# Altium schematic sheet 1_P1.schdoc.schdoc
size 220 x 160 mm; Symbol: Sheet-Symbol_A4; Device: Sheet-Symbol_A4; Company: 杭州科技职业技术学院; Version: V1.0; Page Size: A5; @Project Name: 2024毕设; @Page Count: 1; @Update Date: 2024-05-05; @Create Date: 2024-05-05; @Schematic Name: 充放一体模块; @Page No: 1; @Page Name: P1
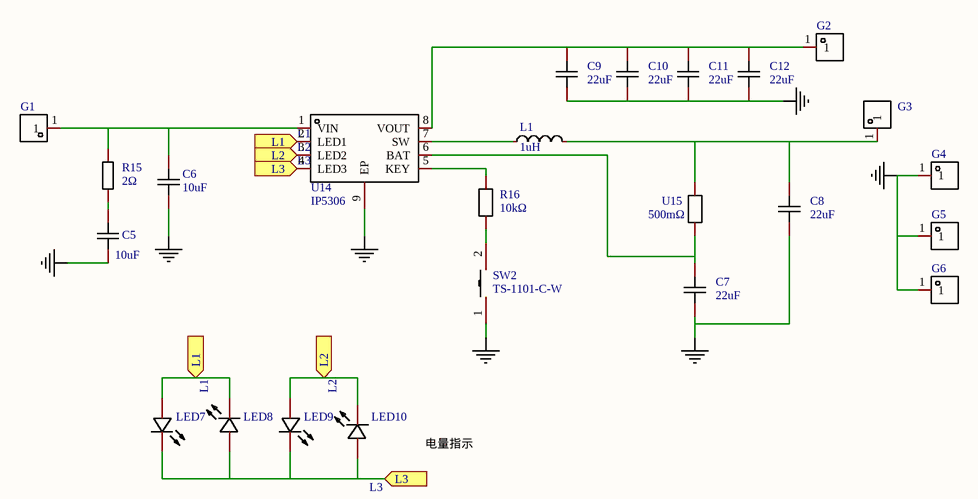
[diagram p0: 1_P1.schdoc.schdoc]

## Parts
C5  10uF  [C0805]
C6  10uF  [C0805]
C7  22uF  [C0805]
C8  22uF  [C0805]
C9  22uF  [C0805]
C10  22uF  [C0805]
C11  22uF  [C0805]
C12  22uF  [C0805]
G1  封闭邮票焊盘  [1P]  (value not drawn)
G2  封闭邮票焊盘  [1P]  (value not drawn)
G3  封闭邮票焊盘  [1P]  (value not drawn)
G4  封闭邮票焊盘  [1P]  (value not drawn)
G5  封闭邮票焊盘  [1P]  (value not drawn)
G6  封闭邮票焊盘  [1P]  (value not drawn)
L1  1uH  [IND-SMD_L4.4-W4.2]
LED7  NCD0805R1  [LED0805-R-RD]  (value not drawn)
LED8  NCD0805R1  [LED0805-R-RD]  (value not drawn)
LED9  NCD0805R1  [LED0805-R-RD]  (value not drawn)
LED10  NCD0805R1  [LED0805-R-RD]  (value not drawn)
R15  2Ω  [R0805]
R16  10kΩ  [R0805]
SW2  TS-1101-C-W  [SW-SMD_L6.0-W3.3-LS8.0]
U14  IP5306  [ESOP-8_L4.9-W3.9-P1.27-LS6.0-BL-EP]
U15  500mΩ  [R0805]

## Ports
L1 (in), L2 (in), L3 (in)

## Nets
NetC5_2: C5.2 C6.1 C7.1 C8.1 C9.1 C10.1 C11.2 C12.1 G4.1 G5.1 G6.1 SW2.1 U14.9(EP)
L1: LED7.1(+) LED8.2(-) U14.2(LED1) ; port L1
L2: LED9.1(+) LED10.2(-) U14.3(LED2) ; port L2
L3: LED7.2(-) LED8.1(+) LED9.2(-) LED10.1(+) U14.4(LED3) ; port L3
NetC5_1: C5.1 R15.1
NetC6_2: C6.2 G1.1 R15.2 U14.1(VIN)
NetC7_2: C7.2 U14.6(BAT) U15.1
NetC8_2: C8.2 G3.1 L1.2 U15.2
NetC9_2: C9.2 C10.2 C11.1 C12.2 G2.1 U14.8(VOUT)
NetL1_1: L1.1 U14.7(SW)
NetR16_1: R16.1 SW2.2
NetR16_2: R16.2 U14.5(KEY)

## Notes on the sheet
- 电量指示
- 1
- 2
- 3
- 4
- 5
- 6
- A
- B
- C
- 原理图
- 充放一体模块
- 创建日期
- 更新日期
- 2024-05-05
- 审阅
- 绘制
- 图页
- P1
- 物料编码
- 2024毕设
- D
- 版本
- 尺寸
- 页
- 共
- V1.0
- A5
- 杭州科技职业技术学院

## Library data of the parts
C5 C6 = GRM21BR61H106KE43L: Manufacturer: muRata(村田); Add into BOM: yes; Tolerance: ±10%; Voltage Rated: 50V; Temperature Coefficient: X5R; Description: 容值:10uF;精度:±10%;额定电压:50V;材质(温度系数):X5R;; Name: 10uF; Symbol: GRM21BR61H106KE43L; Device: GRM21BR61H106KE43L; Supplier: LCSC; Supplier Part: C440198; Manufacturer Part: GRM21BR61H106KE43L; Value: 10uF; JLCPCB Part Class: 基础库; LCSC Part Name: 10uF ±10% 50V; Supplier Footprint: 0805; Datasheet: https://atta.szlcsc.com/upload/public/pdf/source/20230811/95AAE0C9AF55EDC31B7A4D8B733F534E.pdf; Convert to PCB: yes
C7-C12 = CL21A226MAYNNNE: Manufacturer: SAMSUNG(三星); Add into BOM: yes; Tolerance: ±20%; Voltage Rated: 25V; Temperature Coefficient: X5R; Description: 容值:22uF;精度:±20%;额定电压:25V;材质(温度系数):X5R;; Name: 22uF; Symbol: CL21A226MAYNNNE; Device: CL21A226MAYNNNE; LCSC Part Name: 22uF ±20% 25V; Supplier Part: C602037; Manufacturer Part: CL21A226MAYNNNE; Supplier Footprint: 0805; JLCPCB Part Class: 扩展库; Datasheet: https://atta.szlcsc.com/upload/public/pdf/source/20200609/C602037_1A0D619693E608A1BF6E80154254E2DB.pdf; Supplier: LCSC; Convert to PCB: yes; Value: 22uF
G1-G6 = 封闭邮票焊盘: Add into BOM: yes; Name: 封闭邮票焊盘; Symbol: 封闭邮票焊盘; Device: 封闭邮票焊盘; Convert to PCB: yes
L1 = FXL0420-1R0-M: Manufacturer: cjiang(长江微电); Add into BOM: yes; Tolerance: ±20%; Rated Current: 6A; Saturation Current (Isat): 7A; DC Resistance (DCR): 27mΩ; Type: 一体成型电感; Description: 电感值:1uH;精度:±20%;额定电流:6A;饱和电流(Isat):7A;类型:一体成型电感;; Name: 1uH; Symbol: FXL0420-1R0-M; Device: FXL0420-1R0-M; LCSC Part Name: 1uH ±20% 7A; Supplier Part: C167203; Manufacturer Part: FXL0420-1R0-M; Supplier Footprint: SMD,4.2x4.4mm; JLCPCB Part Class: 扩展库; Datasheet: https://atta.szlcsc.com/upload/public/pdf/source/20230516/FBADA9890E7FBE97C620F1D8B562D733.pdf; Supplier: LCSC; Convert to PCB: yes; Value: 1uH
LED7-LED10 = NCD0805R1: Manufacturer: 国星光电; Symbol: FC-2012HRK-620D; Add into BOM: yes; Emitted Color: 红色; Forward Voltage (VF): 1.6V~2.6V; Power Dissipation: 65mW; Forward Current: 20mA; Dominant Wavelength: 615nm~630nm; Diode Configuration: 独立二极管; Lens Color: 无色透明透镜; Luminous Intensity: 67mcd~195mcd; Viewing Angle: 130°; Description: 灯头类型:-;发光颜色:红色;正向电压(VF):1.6V~2.6V;功率:65mW;正向电流:20mA;主波长:615nm~630nm;二极管配置:独立二极管;透镜颜色:无色透明透镜;色温:-;发光强度:67mcd~195mcd;发光角度:130°;载带方式:-;工作温度:-30℃~+85℃;; Device: NCD0805R1; Supplier: LCSC; Manufacturer Part: NCD0805R1; Supplier Part: C84256; JLCPCB Part Class: 基础库; LCSC Part Name: NCD0805R1; Supplier Footprint: 0805; Datasheet: https://atta.szlcsc.com/upload/public/pdf/source/20200820/C84256_F0A75A43B3EAD75808600A0514C76B99.pdf; Convert to PCB: yes; Lamp Holder Type: -; Peak Wavelength: -; Color Temperature: -; Mounting Sytle: -; Operating Temperature: -30℃~+85℃
R15 = 0805W8F200KT5E: Manufacturer: UNI-ROYAL(厚声); Add into BOM: yes; Tolerance: ±1%; Power(Watts): 125mW; Overload Voltage (Max): 150V; Temperature Coefficient: ±400ppm/℃; Description: 电阻类型:厚膜电阻;阻值:2Ω;精度:±1%;功率:125mW;最大工作电压:150V;温度系数:±400ppm/℃;; Name: 2Ω; Symbol: 0805W8F200KT5E; Device: 0805W8F200KT5E; LCSC Part Name: 2Ω ±1% 125mW 厚膜电阻; Supplier Part: C17606; Manufacturer Part: 0805W8F200KT5E; Supplier Footprint: 0805; JLCPCB Part Class: 扩展库; Datasheet: https://atta.szlcsc.com/upload/public/pdf/source/20200306/C422600_1E6D84923E4A46A82E41ADD87F860B5C.pdf; Supplier: LCSC; Convert to PCB: yes; Type: 厚膜电阻; Value: 2Ω; Operating Temperature Range: -55℃~+155℃
R16 = FRC0805J103TS: Manufacturer: FOJAN(富捷); Add into BOM: yes; Tolerance: ±5%; Power(Watts): 125mW; Overload Voltage (Max): 150V; Temperature Coefficient: ±100ppm/℃; Description: 电阻类型:厚膜电阻;阻值:10kΩ;精度:±5%;功率:125mW;最大工作电压:150V;温度系数:±100ppm/℃;; Name: 10kΩ; Symbol: FRC0805J103TS; Device: FRC0805J103TS; LCSC Part Name: 10kΩ ±5% 125mW 厚膜电阻; Supplier Part: C2930231; Manufacturer Part: FRC0805J103TS; Supplier Footprint: 0805; JLCPCB Part Class: 扩展库; Datasheet: https://atta.szlcsc.com/upload/public/pdf/source/20211221/925EC7D7225764EE0046F22065062C87.pdf; Supplier: LCSC; Convert to PCB: yes; Type: 厚膜电阻; Value: 10kΩ; Operating Temperature Range: -55℃~+155℃
SW2 = TS-1101-C-W: Manufacturer: XKB Connectivity(中国星坤); Add into BOM: yes; Circuit: 单刀单掷; Actuator Style: 矩形按钮; Operating Force: 260gf; Switch Length: 6mm; Switch Width: 3.6mm; Switch Height: 2.5mm; Strike Gundam: 不带; Contact Current: 50mA; Voltage Rating (DC): 12V; Actuator/Cap Color: 白色带淡绿; With Lamp: 无; Mechanical Life: 5万次; Description: 电路结构:单刀单掷;按钮形状:矩形按钮;作用力:260gf;安装方式:立贴;开关长度:6mm;开关宽度:3.6mm;开关高度:2.5mm;带支架:不带;触点电流:50mA;额定电压(AC):-;额定电压(DC):12V;额定功率:-;绝缘电阻:-;带灯:无;机械寿命:5万次;; Name: TS-1101-C-W; Symbol: TS-1101-C-W; Device: TS-1101-C-W; LCSC Part Name: 6*3.6*2.5mm 立贴 轻触开关; Supplier Part: C318938; Manufacturer Part: TS-1101-C-W; Supplier Footprint: SMD; JLCPCB Part Class: 扩展库; Datasheet: https://atta.szlcsc.com/upload/public/pdf/source/20200227/C318938_C2E53B1EEDE37D980A33616AC086DE53.pdf; Supplier: LCSC; Convert to PCB: yes; Mounting Style: 立贴; Voltage Rating (AC): -; Power Rating: -; Insulation Resistance: -; IP Rating: -; Pin Style: -; Operating Temperature: -30℃~+85℃
U14 = IP5306: Manufacturer: INJOINIC(英集芯); Add into BOM: yes; Description: 2.1A充电2.4A放电高集成度移动电源SOC; Name: IP5306; Symbol: IP5306; Device: IP5306; LCSC Part Name: IP5306; Supplier Part: C181692; Manufacturer Part: IP5306; Supplier Footprint: ESOP-8; JLCPCB Part Class: 扩展库; Datasheet: https://atta.szlcsc.com/upload/public/pdf/source/20190627/C384572_9925B3DDC4041BC6108E5AB46A2A0AB1.pdf; Supplier: LCSC; Convert to PCB: yes
U15 = FRL0805JR500TS: Manufacturer: FOJAN(富捷); Add into BOM: yes; Tolerance: ±5%; Power(Watts): 125mW; Overload Voltage (Max): 300V; Temperature Coefficient: ±300ppm/℃; Description: 电阻类型:厚膜电阻;阻值:500mΩ;精度:±5%;功率:125mW;最大工作电压:300V;温度系数:±300ppm/℃;; Name: 500mΩ; Symbol: FRL0805JR500TS; Device: FRL0805JR500TS; LCSC Part Name: 500mΩ ±5% 125mW 厚膜电阻; Supplier Part: C2934281; Manufacturer Part: FRL0805JR500TS; Supplier Footprint: 0805; JLCPCB Part Class: 扩展库; Datasheet: https://atta.szlcsc.com/upload/public/pdf/source/20211221/925EC7D7225764EE0046F22065062C87.pdf; Supplier: LCSC; Convert to PCB: yes; Type: 厚膜电阻; Value: 500mΩ; Operating Temperature Range: -55℃~+155℃